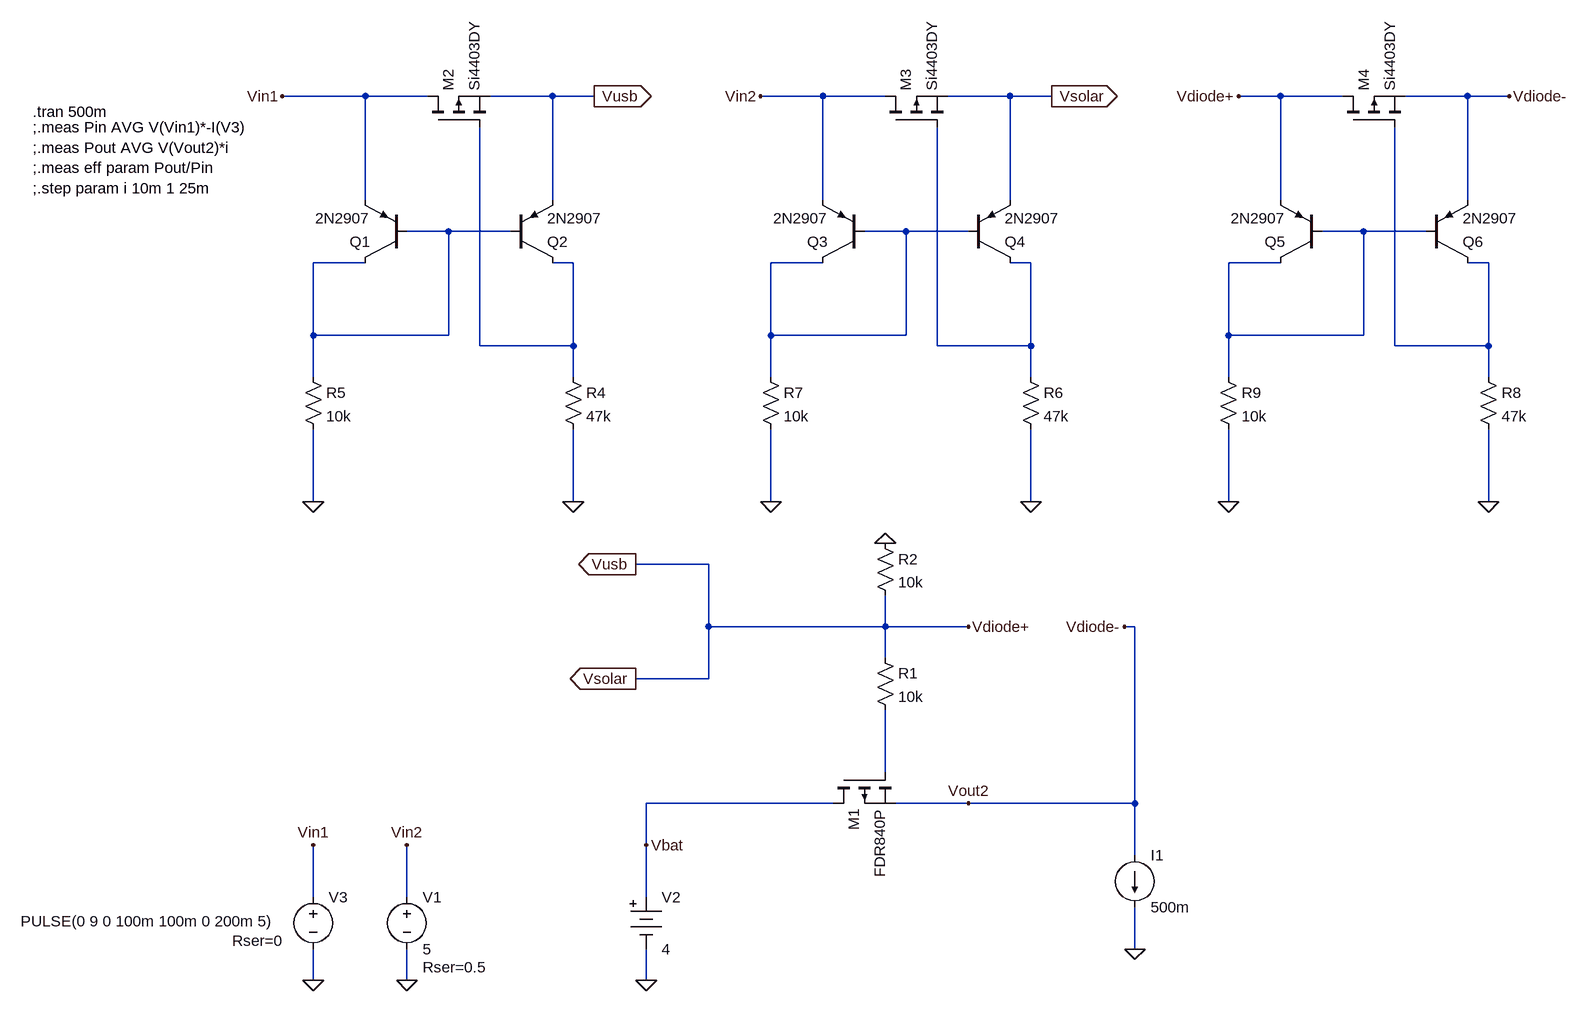
[diagram p0: schematic powerpath_envcity.asc]
powerpath_envcity.asc, the LTspice schematic file:
Version 4
SHEET 1 2336 1236
WIRE 176 -800 48 -800
WIRE 272 -800 176 -800
WIRE 464 -800 368 -800
WIRE 528 -800 464 -800
WIRE 880 -800 784 -800
WIRE 976 -800 880 -800
WIRE 1168 -800 1072 -800
WIRE 1232 -800 1168 -800
WIRE 1584 -800 1520 -800
WIRE 1680 -800 1584 -800
WIRE 1872 -800 1776 -800
WIRE 1936 -800 1872 -800
WIRE 176 -640 176 -800
WIRE 464 -640 464 -800
WIRE 880 -640 880 -800
WIRE 1168 -640 1168 -800
WIRE 1584 -640 1584 -800
WIRE 1872 -640 1872 -800
WIRE 304 -592 240 -592
WIRE 400 -592 304 -592
WIRE 1008 -592 944 -592
WIRE 1104 -592 1008 -592
WIRE 1712 -592 1648 -592
WIRE 1808 -592 1712 -592
WIRE 176 -544 96 -544
WIRE 496 -544 464 -544
WIRE 880 -544 800 -544
WIRE 1200 -544 1168 -544
WIRE 1584 -544 1504 -544
WIRE 1904 -544 1872 -544
WIRE 96 -432 96 -544
WIRE 304 -432 304 -592
WIRE 304 -432 96 -432
WIRE 800 -432 800 -544
WIRE 1008 -432 1008 -592
WIRE 1008 -432 800 -432
WIRE 1504 -432 1504 -544
WIRE 1712 -432 1712 -592
WIRE 1712 -432 1504 -432
WIRE 352 -416 352 -752
WIRE 496 -416 496 -544
WIRE 496 -416 352 -416
WIRE 1056 -416 1056 -752
WIRE 1200 -416 1200 -544
WIRE 1200 -416 1056 -416
WIRE 1760 -416 1760 -752
WIRE 1904 -416 1904 -544
WIRE 1904 -416 1760 -416
WIRE 96 -368 96 -432
WIRE 496 -368 496 -416
WIRE 800 -368 800 -432
WIRE 1200 -368 1200 -416
WIRE 1504 -368 1504 -432
WIRE 1904 -368 1904 -416
WIRE 96 -176 96 -288
WIRE 496 -176 496 -288
WIRE 800 -176 800 -288
WIRE 1200 -176 1200 -288
WIRE 1504 -176 1504 -288
WIRE 1904 -176 1904 -288
WIRE 704 -80 592 -80
WIRE 704 16 704 -80
WIRE 976 16 976 -32
WIRE 976 16 704 16
WIRE 1104 16 976 16
WIRE 1360 16 1344 16
WIRE 976 64 976 16
WIRE 704 96 704 16
WIRE 704 96 592 96
WIRE 976 240 976 144
WIRE 896 288 608 288
WIRE 1104 288 992 288
WIRE 1360 288 1360 16
WIRE 1360 288 1104 288
WIRE 608 352 608 288
WIRE 1360 368 1360 288
WIRE 96 432 96 352
WIRE 240 432 240 352
WIRE 608 432 608 352
WIRE 1360 512 1360 448
WIRE 96 560 96 512
WIRE 240 560 240 512
WIRE 608 560 608 512
FLAG 240 560 0
FLAG 240 352 Vin2
FLAG 608 560 0
FLAG 1104 288 Vout2
FLAG 96 560 0
FLAG 96 352 Vin1
FLAG 608 352 Vbat
FLAG 48 -800 Vin1
FLAG 784 -800 Vin2
FLAG 96 -176 0
FLAG 496 -176 0
FLAG 800 -176 0
FLAG 1200 -176 0
FLAG 528 -800 Vusb
IOPIN 528 -800 Out
FLAG 1232 -800 Vsolar
IOPIN 1232 -800 Out
FLAG 592 96 Vsolar
IOPIN 592 96 Out
FLAG 592 -80 Vusb
IOPIN 592 -80 Out
FLAG 1360 512 0
FLAG 1520 -800 Vdiode+
FLAG 1504 -176 0
FLAG 1904 -176 0
FLAG 1936 -800 Vdiode-
FLAG 1104 16 Vdiode+
FLAG 1344 16 Vdiode-
FLAG 976 -112 0
DATAFLAG 240 384 ""
DATAFLAG 1360 288 ""
DATAFLAG 656 288 ""
DATAFLAG 96 384 ""
DATAFLAG 800 16 ""
DATAFLAG 96 -400 ""
DATAFLAG 496 -416 ""
DATAFLAG 176 -704 "$-V(N009)"
DATAFLAG 800 -400 ""
DATAFLAG 1200 -416 ""
DATAFLAG 880 -704 "$-V(N009)"
DATAFLAG 208 -800 ""
DATAFLAG 464 -800 ""
DATAFLAG 880 -800 ""
DATAFLAG 1168 -800 ""
DATAFLAG 1504 -400 ""
DATAFLAG 1904 -416 ""
DATAFLAG 1584 -704 "$-V(N009)"
DATAFLAG 1584 -800 ""
DATAFLAG 1872 -800 ""
SYMBOL voltage 240 416 R0
WINDOW 123 0 0 Left 0
WINDOW 39 24 124 Left 2
SYMATTR SpiceLine Rser=0.5
SYMATTR InstName V1
SYMATTR Value 5
SYMBOL pmos 896 240 M90
SYMATTR InstName M1
SYMATTR Value FDR840P
SYMBOL res 960 48 R0
SYMATTR InstName R1
SYMATTR Value 10k
SYMBOL Misc\\battery 608 416 R0
WINDOW 123 0 0 Left 0
WINDOW 39 0 0 Left 0
SYMATTR InstName V2
SYMATTR Value 4
SYMBOL voltage 96 416 R0
WINDOW 123 0 0 Left 0
WINDOW 39 -125 83 Left 2
WINDOW 3 -450 53 Left 2
SYMATTR SpiceLine Rser=0
SYMATTR InstName V3
SYMATTR Value PULSE(0 9 0 100m 100m 0 200m 5)
SYMBOL pmos 272 -752 R270
SYMATTR InstName M2
SYMATTR Value Si4403DY
SYMBOL pnp 240 -544 R180
SYMATTR InstName Q1
SYMATTR Value 2N2907
SYMBOL pnp 400 -544 M180
SYMATTR InstName Q2
SYMATTR Value 2N2907
SYMBOL res 480 -384 R0
SYMATTR InstName R4
SYMATTR Value 47k
SYMBOL res 80 -384 R0
SYMATTR InstName R5
SYMATTR Value 10k
SYMBOL pmos 976 -752 R270
SYMATTR InstName M3
SYMATTR Value Si4403DY
SYMBOL pnp 944 -544 R180
SYMATTR InstName Q3
SYMATTR Value 2N2907
SYMBOL pnp 1104 -544 M180
SYMATTR InstName Q4
SYMATTR Value 2N2907
SYMBOL res 1184 -384 R0
SYMATTR InstName R6
SYMATTR Value 47k
SYMBOL res 784 -384 R0
SYMATTR InstName R7
SYMATTR Value 10k
SYMBOL pmos 1680 -752 R270
SYMATTR InstName M4
SYMATTR Value Si4403DY
SYMBOL pnp 1648 -544 R180
SYMATTR InstName Q5
SYMATTR Value 2N2907
SYMBOL pnp 1808 -544 M180
SYMATTR InstName Q6
SYMATTR Value 2N2907
SYMBOL res 1888 -384 R0
SYMATTR InstName R8
SYMATTR Value 47k
SYMBOL res 1488 -384 R0
SYMATTR InstName R9
SYMATTR Value 10k
SYMBOL current 1360 368 R0
WINDOW 123 0 0 Left 0
WINDOW 39 0 0 Left 0
SYMATTR InstName I1
SYMATTR Value 500m
SYMBOL res 960 -128 R0
SYMATTR InstName R2
SYMATTR Value 10k
TEXT -336 -752 Left 2 !;.meas Pin AVG V(Vin1)*-I(V3)\n;.meas Pout AVG V(Vout2)*i\n;.meas eff param Pout/Pin\n;.step param i 10m 1 25m
TEXT -336 -776 Left 2 !.tran 500m

The netlist it stands for:
* powerpath_envcity.asc
V1 Vin2 0 5 Rser=0.5
M1 Vbat N007 Vdiode- Vdiode- FDR840P
R1 Vdiode+ N007 10k
V2 Vbat 0 4
V3 Vin1 0 PULSE(0 9 0 100m 100m 0 200m 5) Rser=0
M2 Vin1 N004 Vdiode+ Vdiode+ Si4403DY
Q1 N001 N001 Vin1 0 2N2907
Q2 N004 N001 Vdiode+ 0 2N2907
R4 N004 0 47k
R5 N001 0 10k
M3 Vin2 N005 Vdiode+ Vdiode+ Si4403DY
Q3 N002 N002 Vin2 0 2N2907
Q4 N005 N002 Vdiode+ 0 2N2907
R6 N005 0 47k
R7 N002 0 10k
M4 Vdiode+ N006 Vdiode- Vdiode- Si4403DY
Q5 N003 N003 Vdiode+ 0 2N2907
Q6 N006 N003 Vdiode- 0 2N2907
R8 N006 0 47k
R9 N003 0 10k
I1 Vdiode- 0 500m
R2 0 Vdiode+ 10k
.model NPN NPN
.model PNP PNP
.lib standard.bjt
.model NMOS NMOS
.model PMOS PMOS
.lib standard.mos
;.meas Pin AVG V(Vin1)*-I(V3)
;.meas Pout AVG V(Vout2)*i
;.meas eff param Pout/Pin
;.step param i 10m 1 25m
.tran 500m
.backanno
.end